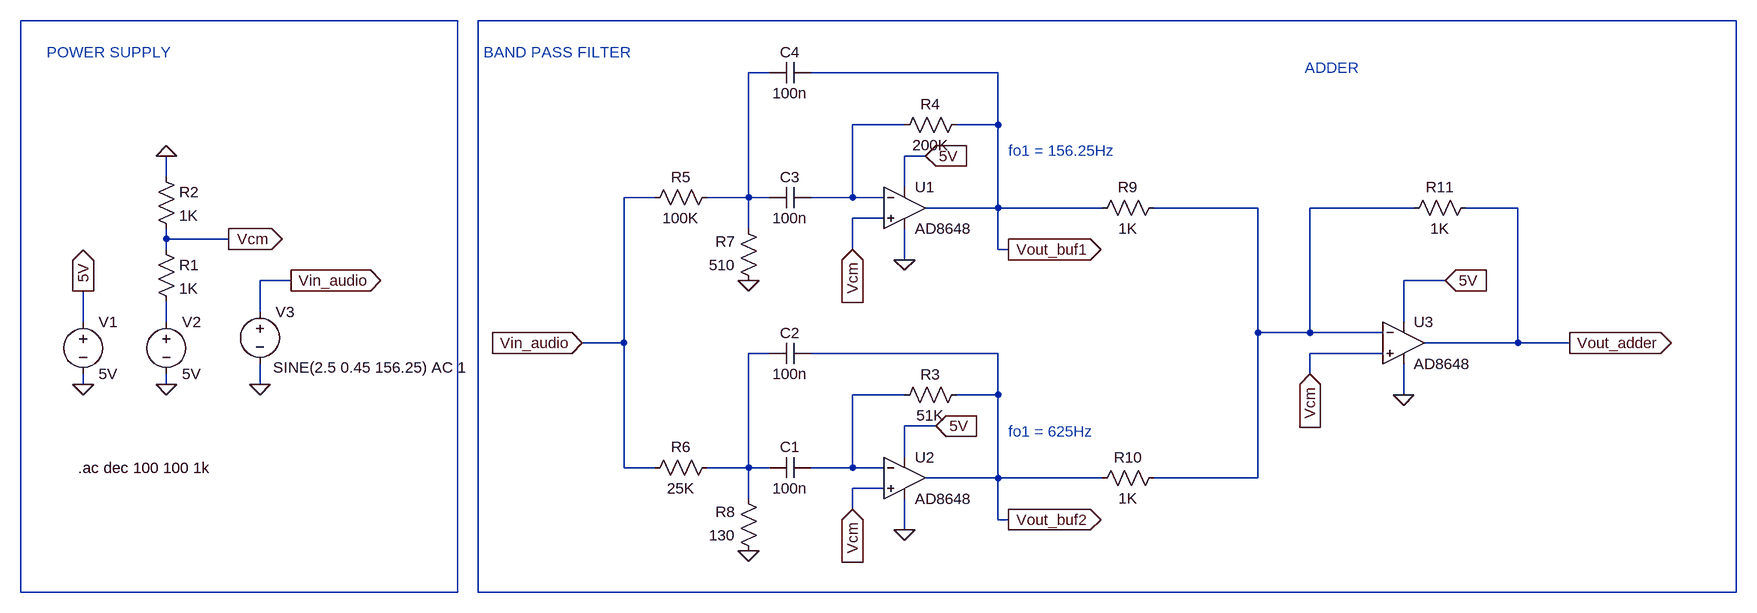
[diagram p0: schematic 05_Summing_Amplifier.asc.asc]
05_Summing_Amplifier.asc.asc, the LTspice schematic file:
Version 4.1
SHEET 1 2452 680
WIRE 320 -256 -352 -256
WIRE 2288 -256 352 -256
WIRE 800 -176 768 -176
WIRE 1152 -176 864 -176
WIRE 1008 -96 928 -96
WIRE 1152 -96 1152 -176
WIRE 1152 -96 1088 -96
WIRE 1040 -48 1008 -48
WIRE -128 -16 -128 -48
WIRE 1008 0 1008 -48
WIRE 624 16 576 16
WIRE 768 16 768 -176
WIRE 768 16 704 16
WIRE 800 16 768 16
WIRE 928 16 928 -96
WIRE 928 16 864 16
WIRE 976 16 928 16
WIRE 1152 32 1152 -96
WIRE 1152 32 1040 32
WIRE 1312 32 1152 32
WIRE 1552 32 1392 32
WIRE 1792 32 1632 32
WIRE 1952 32 1872 32
WIRE 976 48 928 48
WIRE 768 64 768 16
WIRE -128 80 -128 64
WIRE -32 80 -128 80
WIRE -128 96 -128 80
WIRE 928 96 928 48
WIRE 1152 96 1152 32
WIRE 1168 96 1152 96
WIRE 1008 112 1008 64
WIRE 64 144 16 144
WIRE 1840 144 1776 144
WIRE 16 192 16 144
WIRE -256 208 -256 160
WIRE -128 208 -128 176
WIRE 1776 208 1776 144
WIRE 1552 224 1552 32
WIRE 1632 224 1632 32
WIRE 1632 224 1552 224
WIRE 1744 224 1632 224
WIRE 576 240 576 16
WIRE 576 240 512 240
WIRE 1952 240 1952 32
WIRE 1952 240 1808 240
WIRE 2032 240 1952 240
WIRE 800 256 768 256
WIRE 1152 256 864 256
WIRE 1744 256 1632 256
WIRE 1632 288 1632 256
WIRE -256 304 -256 288
WIRE -128 304 -128 288
WIRE 16 304 16 272
WIRE 1008 320 928 320
WIRE 1152 320 1152 256
WIRE 1152 320 1088 320
WIRE 1776 320 1776 272
WIRE 1056 368 1008 368
WIRE 1008 416 1008 368
WIRE 576 432 576 240
WIRE 624 432 576 432
WIRE 768 432 768 256
WIRE 768 432 704 432
WIRE 800 432 768 432
WIRE 928 432 928 320
WIRE 928 432 864 432
WIRE 976 432 928 432
WIRE 1152 448 1152 320
WIRE 1152 448 1040 448
WIRE 1312 448 1152 448
WIRE 1552 448 1552 224
WIRE 1552 448 1392 448
WIRE 976 464 928 464
WIRE 768 480 768 432
WIRE 928 496 928 464
WIRE 1152 512 1152 448
WIRE 1168 512 1152 512
WIRE 1008 528 1008 480
WIRE -352 624 -352 -256
WIRE 320 624 320 -256
WIRE 320 624 -352 624
WIRE 352 624 352 -256
WIRE 2288 624 2288 -256
WIRE 2288 624 352 624
FLAG -256 304 0
FLAG -256 160 5V
IOPIN -256 160 Out
FLAG -128 304 0
FLAG -128 -48 0
FLAG -32 80 Vcm
IOPIN -32 80 Out
FLAG 16 304 0
FLAG 64 144 Vin_audio
IOPIN 64 144 Out
FLAG 1008 112 0
FLAG 1008 528 0
FLAG 928 96 Vcm
IOPIN 928 96 In
FLAG 928 496 Vcm
IOPIN 928 496 In
FLAG 1040 -48 5V
IOPIN 1040 -48 In
FLAG 1056 368 5V
IOPIN 1056 368 In
FLAG 768 144 0
FLAG 768 560 0
FLAG 512 240 Vin_audio
IOPIN 512 240 In
FLAG 1168 96 Vout_buf1
IOPIN 1168 96 Out
FLAG 1168 512 Vout_buf2
IOPIN 1168 512 Out
FLAG 2032 240 Vout_adder
IOPIN 2032 240 Out
FLAG 1632 288 Vcm
IOPIN 1632 288 In
FLAG 1840 144 5V
IOPIN 1840 144 In
FLAG 1776 320 0
SYMBOL voltage -256 192 R0
WINDOW 123 0 0 Left 0
WINDOW 39 0 0 Left 0
SYMATTR InstName V1
SYMATTR Value 5V
SYMBOL voltage -128 192 R0
WINDOW 123 0 0 Left 0
WINDOW 39 0 0 Left 0
SYMATTR InstName V2
SYMATTR Value 5V
SYMBOL res -144 80 R0
SYMATTR InstName R1
SYMATTR Value 1K
SYMBOL res -144 -32 R0
SYMATTR InstName R2
SYMATTR Value 1K
SYMBOL voltage 16 176 R0
WINDOW 3 20 102 Left 2
WINDOW 123 0 0 Left 0
WINDOW 39 0 0 Left 0
SYMATTR Value SINE(2.5 0.45 156.25) AC 1
SYMATTR InstName V3
SYMBOL OpAmps\\AD8648 1008 -32 R0
SYMATTR InstName U1
SYMBOL OpAmps\\AD8648 1008 384 R0
SYMATTR InstName U2
SYMBOL res 1104 304 R90
WINDOW 0 0 56 VBottom 2
WINDOW 3 32 56 VTop 2
SYMATTR InstName R3
SYMATTR Value 51K
SYMBOL res 1104 -112 R90
WINDOW 0 0 56 VBottom 2
WINDOW 3 32 56 VTop 2
SYMATTR InstName R4
SYMATTR Value 200K
SYMBOL cap 864 416 R90
WINDOW 0 0 32 VBottom 2
WINDOW 3 32 32 VTop 2
SYMATTR InstName C1
SYMATTR Value 100n
SYMBOL res 720 0 R90
WINDOW 0 0 56 VBottom 2
WINDOW 3 32 56 VTop 2
SYMATTR InstName R5
SYMATTR Value 100K
SYMBOL res 720 416 R90
WINDOW 0 0 56 VBottom 2
WINDOW 3 32 56 VTop 2
SYMATTR InstName R6
SYMATTR Value 25K
SYMBOL res 784 160 R180
WINDOW 0 36 76 Left 2
WINDOW 3 36 40 Left 2
SYMATTR InstName R7
SYMATTR Value 510
SYMBOL res 784 576 R180
WINDOW 0 36 76 Left 2
WINDOW 3 36 40 Left 2
SYMATTR InstName R8
SYMATTR Value 130
SYMBOL cap 864 240 R90
WINDOW 0 0 32 VBottom 2
WINDOW 3 32 32 VTop 2
SYMATTR InstName C2
SYMATTR Value 100n
SYMBOL cap 864 0 R90
WINDOW 0 0 32 VBottom 2
WINDOW 3 32 32 VTop 2
SYMATTR InstName C3
SYMATTR Value 100n
SYMBOL cap 864 -192 R90
WINDOW 0 0 32 VBottom 2
WINDOW 3 32 32 VTop 2
SYMATTR InstName C4
SYMATTR Value 100n
SYMBOL OpAmps\\AD8648 1776 176 R0
SYMATTR InstName U3
SYMBOL res 1408 16 R90
WINDOW 0 0 56 VBottom 2
WINDOW 3 32 56 VTop 2
SYMATTR InstName R9
SYMATTR Value 1K
SYMBOL res 1888 16 R90
WINDOW 0 0 56 VBottom 2
WINDOW 3 32 56 VTop 2
SYMATTR InstName R11
SYMATTR Value 1K
SYMBOL res 1408 432 R90
WINDOW 0 0 56 VBottom 2
WINDOW 3 32 56 VTop 2
SYMATTR InstName R10
SYMATTR Value 1K
TEXT -312 -208 Left 2 ;POWER SUPPLY
TEXT 360 -208 Left 2 ;BAND PASS FILTER
TEXT 1168 -56 Left 2 ;fo1 = 156.25Hz
TEXT 1168 376 Left 2 ;fo1 = 625Hz
TEXT 1624 -184 Left 2 ;ADDER
TEXT -264 432 Left 2 !.ac dec 100 100 1k

The netlist it stands for:
* 05_Summing_Amplifier.asc.asc
V1 5V 0 5V
V2 N006 0 5V
R1 Vcm N006 1K
R2 0 Vcm 1K
V3 Vin_audio 0 SINE(2.5 0.45 156.25) AC 1
X§U1 Vcm N004 5V 0 Vout_buf1 AD8648  ; pins In+ In- V+ V- OUT
X§U2 Vcm N008 5V 0 Vout_buf2 AD8648  ; pins In+ In- V+ V- OUT
R3 Vout_buf2 N008 51K
R4 Vout_buf1 N004 200K
C1 N008 N007 100n
R5 N003 Vin_audio 100K
R6 N007 Vin_audio 25K
R7 0 N003 510
R8 0 N007 130
C2 Vout_buf2 N007 100n
C3 N004 N003 100n
C4 Vout_buf1 N003 100n
X§U3 Vcm N005 5V 0 Vout_adder AD8648  ; pins In+ In- V+ V- OUT
R9 N005 Vout_buf1 1K
R11 Vout_adder N005 1K
R10 N005 Vout_buf2 1K
* POWER SUPPLY
* BAND PASS FILTER
* fo1 = 156.25Hz
* fo1 = 625Hz
* ADDER
.ac dec 100 100 1k
.lib ADI.lib
.backanno
.end